# EAGLE design TG16_EXP_RGBSV_RevB (EAGLE 9.6.2)
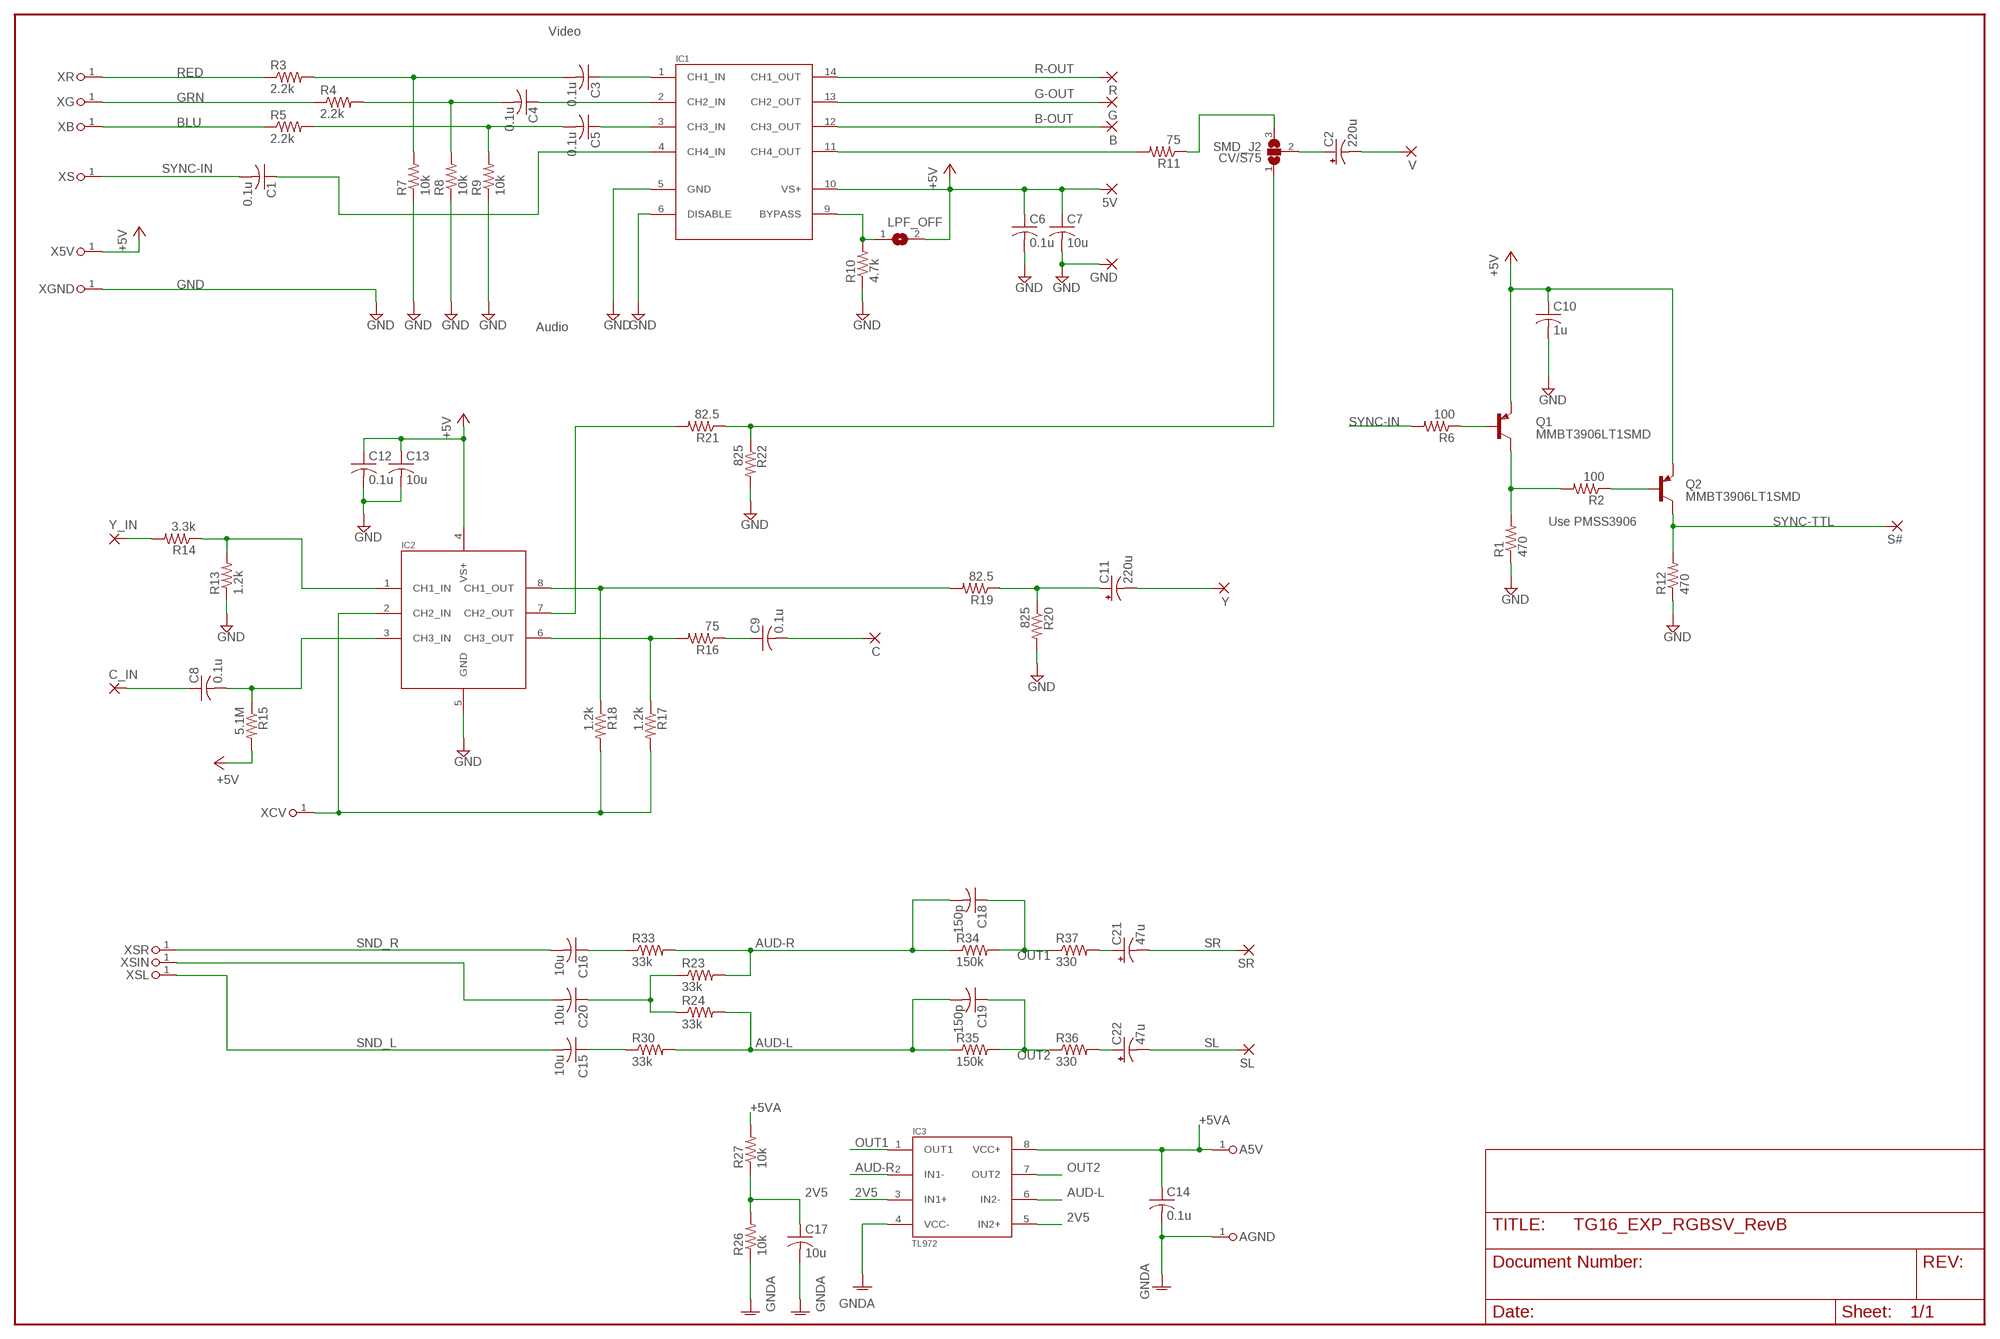
[diagram p0: schematic, sheet 1]

## Parts
5V  SMD2  [SMD1,27-2,54]
A5V  PINHD-1X1  [1X01]
AGND  PINHD-1X1  [1X01]
B  SMD2  [SMD1,27-2,54]
C  SMD2  [SMD1,27-2,54]
C1  0.1u  C-USC0603  [C0603]
C2  220u  CPOL-USCT3528  [CT3528]
C3  0.1u  C-USC0603  [C0603]
C4  0.1u  C-USC0603  [C0603]
C5  0.1u  C-USC0603  [C0603]
C6  0.1u  C-USC0603  [C0603]
C7  10u  C-USC1206  [C1206]
C8  0.1u  C-USC0603  [C0603]
C9  0.1u  C-USC0603  [C0603]
C10  1u  C-USC0603  [C0603]
C11  220u  CPOL-USCT3528  [CT3528]
C12  0.1u  C-USC0603  [C0603]
C13  10u  C-USC1206  [C1206]
C14  0.1u  C-USC0603  [C0603]
C15  10u  C-USC0805  [C0805]
C16  10u  C-USC0805  [C0805]
C17  10u  C-USC1206  [C1206]
C18  150p  C-USC0603  [C0603]
C19  150p  C-USC0603  [C0603]
C20  10u  C-USC0805  [C0805]
C21  47u  CPOL-USCT3528  [CT3528]
C22  47u  CPOL-USCT3528  [CT3528]
C_IN  SMD2  [SMD1,27-2,54]
CV/S75  SMD_J2  [SJ_2]
G  SMD2  [SMD1,27-2,54]
GND  SMD2  [SMD1,27-2,54]
IC1  THS7374TSSOP14_LONG  [TSSOP14LONG]
IC2  THS7314  [SOIC8]
IC3  TL972  [SOIC8]
LPF_OFF  SMD_J  [SJ]
Q1  MMBT3906LT1SMD  [SOT23-BEC]
Q2  MMBT3906LT1SMD  [SOT23-BEC]
R  SMD2  [SMD1,27-2,54]
R1  470  R-US_R0603  [R0603]
R2  100  R-US_R0603  [R0603]
R3  2.2k  R-US_R0603  [R0603]
R4  2.2k  R-US_R0603  [R0603]
R5  2.2k  R-US_R0603  [R0603]
R6  100  R-US_R0603  [R0603]
R7  10k  R-US_R0603  [R0603]
R8  10k  R-US_R0603  [R0603]
R9  10k  R-US_R0603  [R0603]
R10  4.7k  R-US_R0603  [R0603]
R11  75  R-US_R0603  [R0603]
R12  470  R-US_R0603  [R0603]
R13  1.2k  R-US_R0603  [R0603]
R14  3.3k  R-US_R0603  [R0603]
R15  5.1M  R-US_R0603  [R0603]
R16  75  R-US_R0603  [R0603]
R17  1.2k  R-US_R0603  [R0603]
R18  1.2k  R-US_R0603  [R0603]
R19  82.5  R-US_R0603  [R0603]
R20  825  R-US_R0603  [R0603]
R21  82.5  R-US_R0603  [R0603]
R22  825  R-US_R0603  [R0603]
R23  33k  R-US_R0603  [R0603]
R24  33k  R-US_R0603  [R0603]
R26  10k  R-US_R0603  [R0603]
R27  10k  R-US_R0603  [R0603]
R30  33k  R-US_R0603  [R0603]
R33  33k  R-US_R0603  [R0603]
R34  150k  R-US_R0603  [R0603]
R35  150k  R-US_R0603  [R0603]
R36  330  R-US_R0603  [R0603]
R37  330  R-US_R0603  [R0603]
S#  SMD2  [SMD1,27-2,54]
SL  SMD2  [SMD1,27-2,54]
SR  SMD2  [SMD1,27-2,54]
V  SMD2  [SMD1,27-2,54]
X5V  PINHD-1X1  [1X01]
XB  PINHD-1X1  [1X01]
XCV  PINHD-1X1  [1X01]
XG  PINHD-1X1  [1X01]
XGND  PINHD-1X1  [1X01]
XR  PINHD-1X1  [1X01]
XS  PINHD-1X1  [1X01]
XSIN  PINHD-1X1  [1X01]
XSL  PINHD-1X1  [1X01]
XSR  PINHD-1X1  [1X01]
Y  SMD2  [SMD1,27-2,54]
Y_IN  SMD2  [SMD1,27-2,54]

## Nets
2V5: C17.1 IC3.3(IN1+) IC3.5(IN2+) R26.2 R27.1
+5V: 5V.1(P) C6.1 C7.1 C10.1 C12.1 C13.1 IC1.10(VS+) IC2.4(VS+) LPF_OFF.2 Q1.E Q2.E R15.2 X5V.1
+5VA: A5V.1 C14.1 IC3.8(VCC+) R27.2
AUD-L: C19.2 IC3.6(IN2-) R24.2 R30.2 R35.1
AUD-R: C18.2 IC3.2(IN1-) R23.2 R33.2 R34.1
B-OUT: B.1(P) IC1.12(CH3_OUT)
BLU: R5.1 XB.1
G-OUT: G.1(P) IC1.13(CH2_OUT)
GND: C6.2 C7.2 C10.2 C12.2 C13.2 GND.1(P) IC1.5(GND) IC1.6(DISABLE) IC2.5(GND) R1.1 R7.1 R8.1 R9.1 R10.1 R12.1 R13.1 R20.2 R22.2 XGND.1
GNDA: AGND.1 C14.2 C17.2 IC3.4(VCC-) R26.1
GRN: R4.1 XG.1
N$1: Q1.B R6.1
N$2: C3.1 IC1.1(CH1_IN)
N$3: C3.2 R3.2 R7.2
N$4: C4.1 IC1.2(CH2_IN)
N$5: C4.2 R4.2 R8.2
N$6: C5.1 IC1.3(CH3_IN)
N$7: C1.1 IC1.4(CH4_IN)
N$8: C5.2 R5.2 R9.2
N$9: IC1.9(BYPASS) LPF_OFF.1 R10.2
N$10: Q1.C R1.2 R2.2
N$11: IC1.11(CH4_OUT) R11.2
N$12: Q2.B R2.1
N$13: C2.+ CV/S75.2
N$14: C2.- V.1(P)
N$15: R14.2 Y_IN.1(P)
N$16: IC2.1(CH1_IN) R13.2 R14.1
N$17: C8.1 C_IN.1(P)
N$18: C8.2 IC2.3(CH3_IN) R15.1
N$19: IC2.8(CH1_OUT) R18.1 R19.2
N$20: IC2.6(CH3_OUT) R16.2 R17.1
N$21: C9.1 R16.1
N$22: C9.2 C.1(P)
N$23: IC2.2(CH2_IN) R17.2 R18.2 XCV.1
N$24: C11.+ R19.1 R20.1
N$25: C11.- Y.1(P)
N$26: IC2.7(CH2_OUT) R21.2
N$27: CV/S75.3 R11.1
N$28: CV/S75.1 R21.1 R22.1
N$29: C16.1 R33.1
N$30: C20.2 XSIN.1
N$31: C20.1 R23.1 R24.1
N$34: C15.1 R30.1
N$41: C22.+ R36.2
N$42: C21.+ R37.2
OUT1: C18.1 IC3.1(OUT1) R34.2 R37.1
OUT2: C19.1 IC3.7(OUT2) R35.2 R36.1
R-OUT: IC1.14(CH1_OUT) R.1(P)
RED: R3.1 XR.1
SL: C22.- SL.1(P)
SND_L: C15.2 XSL.1
SND_R: C16.2 XSR.1
SR: C21.- SR.1(P)
SYNC-IN: C1.2 R6.2 XS.1
SYNC-TTL: Q2.C R12.2 S#.1(P)

## Notes on the sheet
- Video
- Audio
- Use PMSS3906

## Library data of the parts
5V B C C_IN G GND R S# SL SR V Y Y_IN = wirepad:SMD2: SMD PAD
A5V AGND X5V XB XCV XG XGND XR XS XSIN XSL XSR = My_Devices:PINHD-1X1: PIN HEADER
C1 C3-C10 C12-C20 = My_Devices:C-US: CAPACITOR, American symbol
C2 C11 = rcl:CPOL-US: POLARIZED CAPACITOR, American symbol; SPICEPREFIX: C
C21 C22 = My_Devices:CPOL-US: POLARIZED CAPACITOR, American symbol; SPICEPREFIX: C
CV/S75 = My_Devices:SMD_J2
IC1 = My_Devices:THS7374
IC2 = My_Devices:THS7314
IC3 = My_Devices:TL972
LPF_OFF = My_Devices:SMD_J
Q1 Q2 = transistor-pnp:MMBT3906*: PNP Transistror
R1-R24 R26 R27 R30 R33-R37 = My_Devices:R-US_: RESISTOR, American symbol

## Board
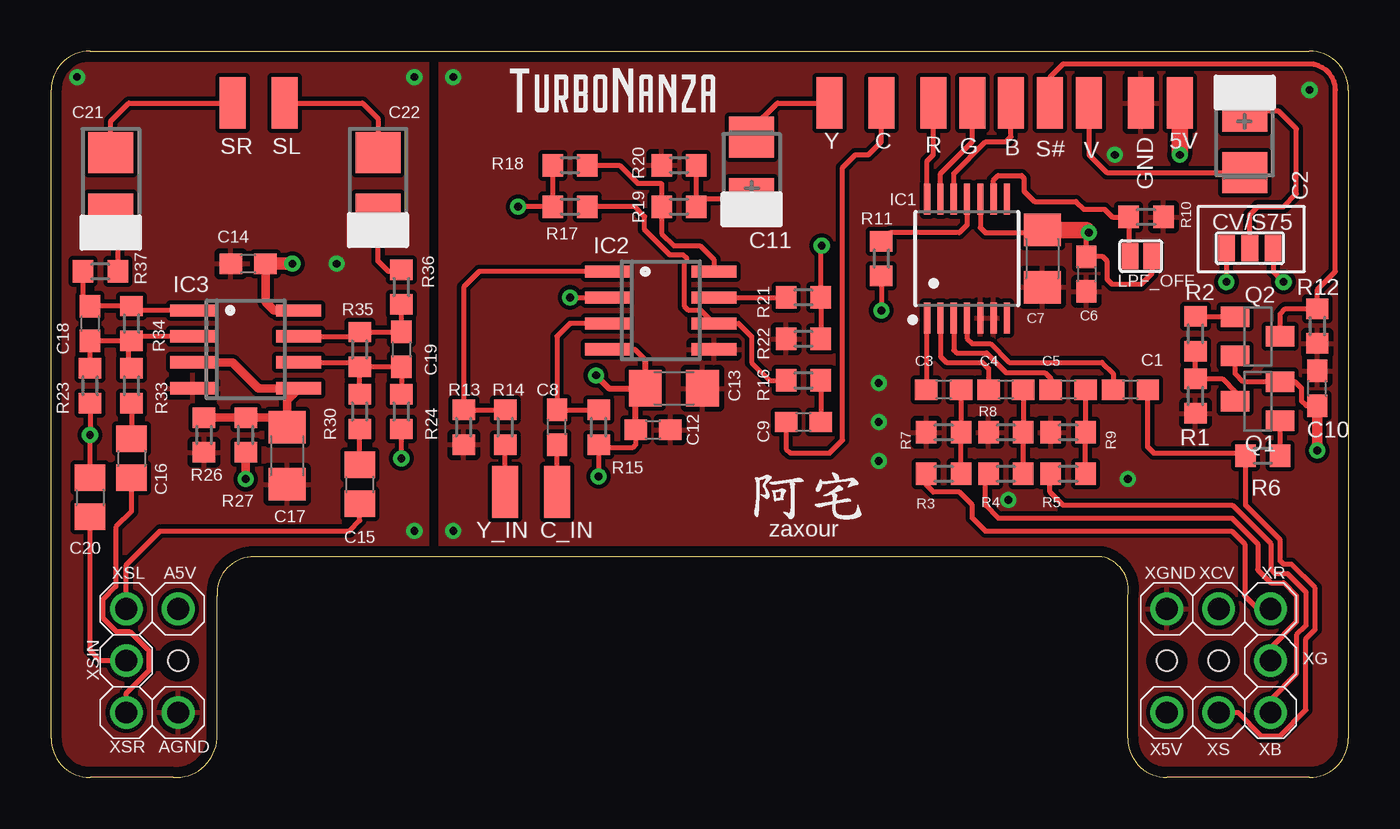
[diagram p1: board, top side]
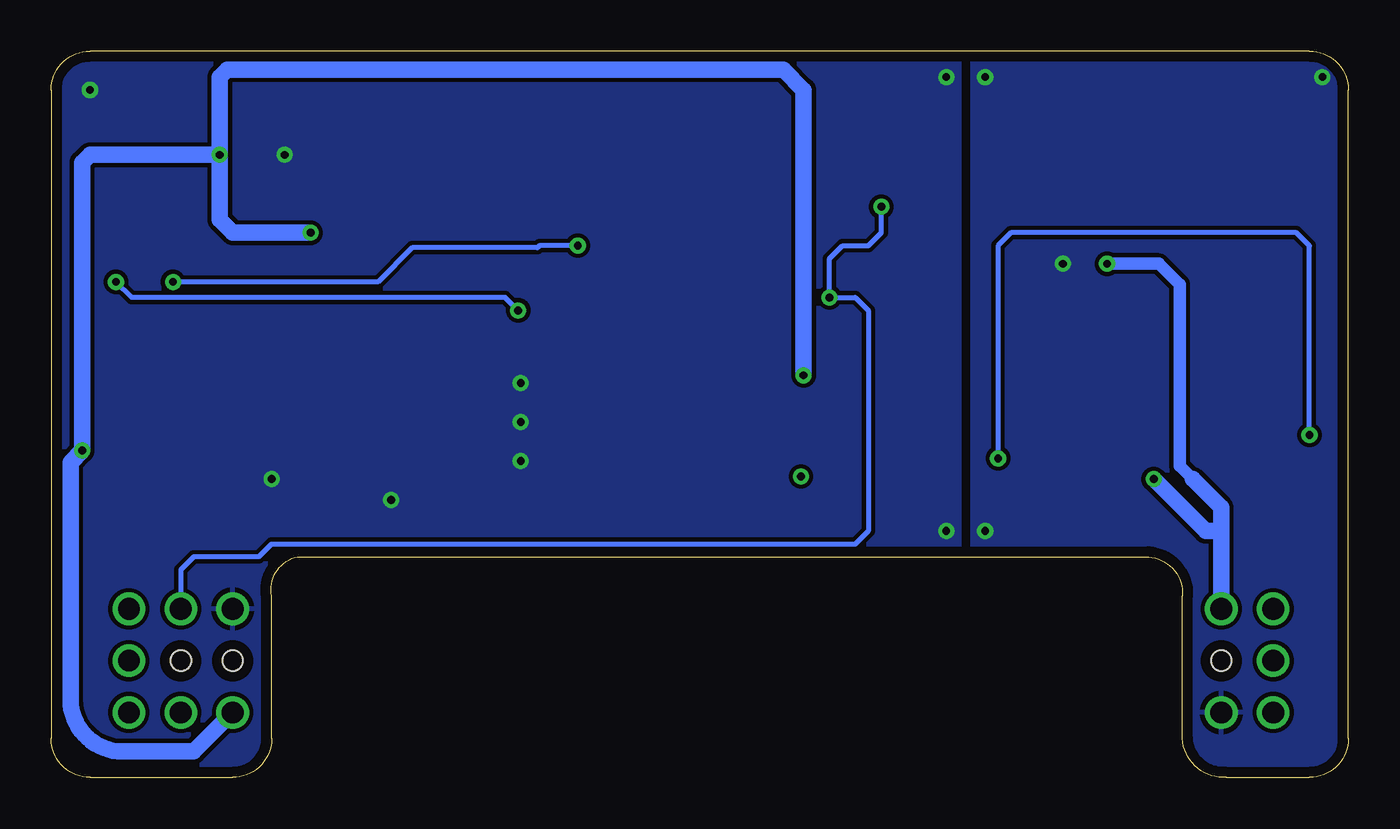
[diagram p2: board, bottom side, seen from below]

Size 63.5 x 35.56 mm. Coordinates in mm from the lower left corner, seen from the top.
Outline: 0,1.91 0,33.66 arc-90 1.91,35.56 61.59,35.56 arc-90 63.5,33.66 63.5,1.91 arc-90 61.59,0 54.61,0 arc-90 52.7,1.91 52.7,8.89 arc90 51.44,10.8 9.78,10.8 arc90 8.13,8.89 8.13,1.91 arc-90 5.97,0 1.91,0 arc-90 0,1.91
Copper layers (1*16): Top 0.035mm / dielectric 1.5mm / Bottom 0.035mm
Design rules "default *": minimum track width 5mil, minimum drill 10mil, track to track 8mil, track to pad 8mil, pad to pad 8mil, via to via 8mil, smd to smd 8mil, copper to edge 20mil, drill to drill 8mil, minimum pad ring 10mil, minimum via ring 8mil, stop-mask expansion 4mil, vias tented up to drill 18mil, thermal gap 10mil
Holes 0.99 mm at 54.61,5.72 57.15,5.72 6.22,5.72

### Footprints (pad centres in the part's own frame; a part is rotated, then mirrored left to right if it is on the bottom)
SMD1,27-2,54 = smd 1.27 x 2.54: 1 0,0
1X01 = drill 1.067 pad 1.575: 1 0,0
C0603 = smd 1.1 x 1: 1 -0.85,0; 2 0.85,0
CT3528 = smd 2 x 2.2: + -1.5,0; - 1.5,0
C1206 = smd 1.6 x 1.8: 1 -1.4,0; 2 1.4,0
C0805 = smd 1.3 x 1.5: 1 -0.95,0; 2 0.95,0
SJ_2 = smd 0.813 x 1.27: 1 -1.143,0; 2 0,0; 3 1.143,0
TSSOP14LONG = smd 0.305 x 1.524: 1 -1.95,-2.918; 2 -1.3,-2.918; 3 -0.65,-2.918; 4 0,-2.918; 5 0.65,-2.918; 6 1.3,-2.918; 7 1.95,-2.918; 8 1.95,2.918; 9 1.3,2.918; 10 0.65,2.918; 11 0,2.918; 12 -0.65,2.918; 13 -1.3,2.918; 14 -1.95,2.918
SOIC8 = smd 0.6 x 2.2: 1 -1.905,-2.6; 2 -0.635,-2.6; 3 0.635,-2.6; 4 1.905,-2.6; 5 1.905,2.6; 6 0.635,2.6; 7 -0.635,2.6; 8 -1.905,2.6
SJ = smd 0.813 x 1.27: 1 -0.533,0; 2 0.533,0
SOT23-BEC = smd 1 x 1.4: B -0.95,-1.1; C 0,1.1; E 0.95,-1.1
R0603 = smd 1 x 1.1: 1 -0.85,0; 2 0.85,0

### Placement (x,y rotation side)
5V  55.24,33.02 0 top
A5V  6.22,8.26 0 top
AGND  6.22,3.18 0 top
B  46.99,33.02 180 top
C  40.64,33.02 0 top
C1  52.83,18.99 0 top
C2  58.42,31.12 270 top
C3  43.69,18.99 0 top
C4  46.74,18.99 0 top
C5  49.78,18.99 0 top
C6  50.67,24.64 270 top
C7  48.51,25.4 270 top
C8  24.77,17.15 90 top
C9  36.83,17.4 180 top
C10  61.98,19.05 90 top
C11  34.29,29.85 90 top
C12  29.46,17.02 0 top
C13  30.48,19.05 0 top
C14  9.65,25.15 180 top
C15  15.11,14.35 270 top
C16  3.94,15.62 270 top
C17  11.56,15.75 270 top
C18  1.91,22.23 270 top
C19  17.14,20.96 270 top
C20  1.91,13.72 270 top
C21  2.92,29.09 90 top
C22  16,29.09 90 top
C_IN  24.77,13.97 0 top
CV/S75  58.67,25.91 0 top
G  45.09,33.02 180 top
GND  53.34,33.02 180 top
IC1  44.83,25.4 0 top
IC2  29.84,22.86 270 top
IC3  9.53,20.96 270 top
LPF_OFF  53.34,25.53 0 top
Q1  59.05,18.42 90 top
Q2  59.05,21.59 270 top
R  43.18,33.02 180 top
R1  56.01,18.67 90 top
R2  56.01,21.72 270 top
R3  43.69,14.86 0 top
R4  46.74,14.86 0 top
R5  49.78,14.86 0 top
R6  59.31,15.75 180 top
R7  43.69,16.89 0 top
R8  46.74,16.89 0 top
R9  49.78,16.89 0 top
R10  53.59,27.44 180 top
R11  40.64,25.4 90 top
R12  61.98,22.1 90 top
R13  20.19,17.15 90 top
R14  22.23,17.15 270 top
R15  26.8,17.15 270 top
R16  36.83,19.43 180 top
R17  25.4,27.94 180 top
R18  25.4,29.98 180 top
R19  30.73,27.94 180 top
R20  30.73,29.98 180 top
R21  36.83,23.5 180 top
R22  36.83,21.47 180 top
R23  1.91,19.18 90 top
R24  17.14,17.91 90 top
R26  7.49,16.77 90 top
R27  9.53,16.77 270 top
R30  15.11,17.91 90 top
R33  3.94,19.18 90 top
R34  3.94,22.23 90 top
R35  15.11,20.96 90 top
R36  17.14,24.01 90 top
R37  2.41,24.77 0 top
S#  48.9,33.02 0 top
SL  11.43,33.02 0 top
SR  8.89,33.02 0 top
V  50.8,33.02 180 top
X5V  54.61,3.18 0 top
XB  59.69,3.18 0 top
XCV  57.15,8.26 0 top
XG  59.69,5.72 0 top
XGND  54.61,8.26 0 top
XR  59.69,8.26 0 top
XS  57.15,3.18 0 top
XSIN  3.68,5.72 0 top
XSL  3.68,8.26 0 top
XSR  3.68,3.18 0 top
Y  38.1,33.02 0 top
Y_IN  22.23,13.97 0 top

### Tracks (layer width: path | path; a pad name or v marks a point on that pad's centre or on a via)
2V5
  Top 0.406: IC3.3 8.89,20.32 10.16,19.05 IC3.5 11.56,18.49 C17.1 11.09,17.62 R27.1 R26.2
+5V  (via drill 0.38)
  Top 0.254: IC1.10 45.48,26.91 45.72,26.67 48.38,26.67 C7.1 | C10.1 61.43,18.2 61.21,18.42 61.21,19.05 60.9,19.37 Q1.E 58.36,19.37 57.95,19.77 Q2.E | 50.67,26.8 C6.1 51.47,25.49 51.69,25.28 51.69,24.39 51.94,24.13 53.34,24.13 53.87,24.67 LPF_OFF.2 | v26.8,14.74 R15.2 26.96,16.13 28.45,16.13 28.61,16.3 C12.1 | IC2.4 28.57,20.96 29.08,20.45
  Top 0.305: v26.67,19.69 27.3,19.05 C13.1 | C12.1 28.61,18.59 C13.1 | 29.08,20.45 C13.1
  Top 0.508: v61.98,16.01 C10.1
  Top 0.813: C7.1 50.67,26.8 v50.8,26.67 | 5V.1 v55.24,30.48
  Bottom 0.813: X5V.1 56.52,1.27 60.01,1.27 arc90 62.55,3.81 62.55,15.43 v61.98,16.01 61.98,30.1 61.59,30.48 v55.24,30.48 | v26.67,19.69 26.67,33.66 27.66,34.65 54.89,34.65 55.24,34.29 v55.24,30.48 | v55.24,30.48 55.24,27.31 54.61,26.67 v50.8,26.67
+5VA  (via drill 0.38)
  Top 0.406: IC3.8 10.92,22.86 10.5,23.28 C14.1 | R27.2 v9.53,14.61
  Top 0.61: v11.81,25.15 C14.1
  Bottom 0.61: 7.62,14.61 8.26,15.24 8.26,24.13 9.27,25.15 v11.81,25.15
  Bottom 0.813: 7.62,14.61 6.22,13.21 6.22,12.07 | A5V.1 6.22,12.07 | v9.53,14.61 6.99,12.07 6.22,12.07
AUD-L
  Top 0.254: R30.2 R35.1 | IC3.6 14.9,20.32 R35.1 | R35.1 C19.2 R24.2
AUD-R
  Top 0.254: R34.1 3.81,21.38 | 3.81,21.38 C18.2 R23.2 | R33.2 3.81,20.16 3.81,21.38 | 3.81,21.38 4.03,21.59 IC3.2
B-OUT
  Top 0.254: IC1.12 44.18,29.57 45.73,31.12 46.74,31.12 46.99,31.37 B.1
BLU
  Top 0.254: R5.1 48.9,14.82 48.9,13.97 49.53,13.34 57.81,13.34 59.69,11.46 59.69,10.18 59.88,9.99 60.51,9.99 61.42,9.08 61.42,7.43 60.96,6.98 60.96,5.08 59.69,3.81 XB.1
G-OUT
  Top 0.254: IC1.13 43.53,29.56 45.09,31.12 G.1
GND  (via drill 0.38)
  other vias: 46.86,13.59 40.51,19.31 40.51,17.4 40.51,15.5 52.07,30.48 19.68,34.29 52.7,14.61 61.59,33.66 19.68,12.07
  pour Top: 19.05,41.91 67.31,41.91 67.31,-4.44 19.05,-4.44
  pour Bottom (rank 2): 19.05,43.18 64.14,43.18 64.14,-1.27 19.05,-1.27
GNDA  (via drill 0.38)
  other vias: 13.97,25.15 17.78,12.07 17.78,34.29 1.27,34.29
  pour Bottom: -1.91,-1.27 -1.91,36.2 18.41,36.2 18.41,-1.27
  pour Top: 18.41,-0.63 18.41,36.83 -0.64,36.83 -0.64,-0.63
GRN
  Top 0.254: R4.1 45.72,14.7 45.72,13.34 46.35,12.7 57.8,12.7 59.05,11.45 59.05,10.16 59.69,9.53 60.33,9.53 60.96,8.89 60.96,7.62 59.69,6.35 XG.1
N$1
  Top 0.254: Q1.B R6.1
N$2
  Top 0.254: IC1.1 42.84,22.44 C3.1
N$3
  Top 0.254: R3.2 R7.2 C3.2
N$4
  Top 0.254: IC1.2 43.53,20.61 43.81,20.32 45.59,20.32 45.89,20.03 C4.1
N$5
  Top 0.254: R4.2 R8.2 C4.2
N$6
  Top 0.254: IC1.3 44.18,20.92 44.32,20.78 45.78,20.78 46.74,19.82 48.27,19.82 48.28,19.82 48.64,19.82 48.93,19.52 C5.1
N$7
  Top 0.254: IC1.4 44.83,21.49 45.09,21.24 45.97,21.24 46.89,20.32 51.44,20.32 51.98,19.78 C1.1
N$8
  Top 0.254: R5.2 R9.2 C5.2
N$9
  Top 0.254: IC1.9 46.13,29.24 46.35,29.47 47.5,29.47 47.62,29.34 47.62,28.71 48.13,28.2 50.16,28.2 50.55,27.82 51.56,27.82 51.94,27.44 R10.2 52.74,25.59 LPF_OFF.1
N$10
  Top 0.254: R2.2 R1.2 57.32,19.52 57.95,18.88 Q1.C
N$11
  Top 0.254: IC1.11 44.83,27.05 44.45,26.67 41.06,26.67 R11.2
N$12
  Top 0.254: R2.1 57.93,22.57 Q2.B
N$13
  Top 0.254: CV/S75.2 58.67,27.56 59.05,27.94 60.33,27.94 60.96,28.58 60.96,31.75 60.09,32.62 C2.+
N$14
  Top 0.254: V.1 50.8,30.48 51.66,29.62 C2.-
N$15
  Top 0.254: Y_IN.1 R14.2
N$16
  Top 0.254: R14.1 R13.2 20.19,24.01 20.95,24.77 IC2.1
N$17
  Top 0.254: C_IN.1 C8.1
N$18
  Top 0.254: IC2.3 25.4,22.23 24.77,21.59 C8.2 R15.1
N$19
  Top 0.254: IC2.8 32.45,25.34 31.75,26.04 30.48,26.04 29.88,26.63 R19.2 29.88,29.06 29.84,29.1 28.69,29.1 27.81,29.98 R18.1
N$20
  Top 0.254: R16.2 35.18,19.43 34.29,20.32 34.29,21.59 33.66,22.23 IC2.6 31.8,22.87 31.21,22.87 31.02,23.06 31.02,25.21 31.11,25.31 31.11,25.4 30.94,25.58 30.29,25.58 29.05,26.82 29.05,27.46 28.57,27.94 R17.1
N$21
  Top 0.254: R16.1 C9.1
N$22
  Top 0.254: C9.2 35.98,16.09 36.2,15.88 38.1,15.88 38.73,16.51 38.73,29.85 39.37,30.48 40.01,30.48 40.64,31.12 C.1
N$23  (via drill 0.38)
  Top 0.254: v25.4,23.5 IC2.2 | R18.2 R17.2 v22.86,27.94
  Bottom 0.254: XCV.1 57.15,10.16 56.52,10.8 53.34,10.8 52.7,11.43 24.13,11.43 23.5,12.07 23.5,22.86 24.13,23.5 v25.4,23.5 25.4,25.4 24.77,26.04 23.5,26.04 22.86,26.67 v22.86,27.94
N$24
  Top 0.254: R20.1 R19.1 31.99,28.35 C11.+
N$25
  Top 0.254: C11.- 34.29,31.75 35.56,33.02 Y.1
N$26
  Top 0.254: IC2.7 R21.2
N$27  (via drill 0.38)
  Top 0.254: R11.1 v40.64,22.86 | CV/S75.3 59.82,24.77 v60.33,24.26
  Bottom 0.254: v60.33,24.26 59.56,23.5 41.27,23.5 v40.64,22.86
N$28  (via drill 0.38)
  Top 0.254: R22.1 R21.1 37.68,26 v37.72,26.04 | CV/S75.1 v57.53,24.26
  Bottom 0.254: v37.72,26.04 39.6,26.04 39.7,25.94 45.82,25.94 47.5,24.26 v57.53,24.26
N$29
  Top 0.254: R33.1 C16.1
N$30
  Top 0.254: XSIN.1 2.41,5.72 1.91,6.23 C20.2
N$31  (via drill 0.38)
  Top 0.254: C20.1 v1.91,16.77 R23.1 | v17.14,15.62 R24.1
  Bottom 0.254: v1.91,16.77 1.91,26.04 2.54,26.67 16.51,26.67 17.14,26.04 v17.14,15.62
N$34
  Top 0.254: C15.1 R30.1
N$41
  Top 0.254: R36.2 17.06,24.77 16.51,24.77 16,25.28 C22.+
N$42
  Top 0.254: C21.+ 3.26,27.24 R37.2
OUT1
  Top 0.254: IC3.1 4.15,22.86 R34.2 C18.1 1.56,23.42 R37.1
OUT2
  Top 0.254: C19.1 17.14,22.23 | 17.14,22.23 R36.1 | IC3.7 14.9,21.59 R35.2 16.73,21.81 17.14,22.23
R-OUT
  Top 0.254: IC1.14 42.88,30.18 43.18,30.48 R.1
RED
  Top 0.254: R3.1 42.84,14.32 43.18,13.97 44.45,13.97 45.09,13.34 45.09,12.7 45.72,12.07 57.78,12.07 58.42,11.43 58.42,8.89 59.05,8.26 XR.1
SL
  Top 0.254: SL.1 15.24,33.02 16,32.26 C22.-
SND_L
  Top 0.254: XSL.1 3.68,10.42 5.33,12.07 14.61,12.07 15.11,12.58 C15.2
SND_R
  Top 0.254: XSR.1 3.68,4.12 4.81,5.25 4.81,6.19 3.87,7.13 3.21,7.13 2.55,7.79 2.55,8.73 3.17,9.35 3.17,12.26 3.94,13.02 C16.2
SR
  Top 0.254: C21.- 2.92,32.13 3.81,33.02 SR.1
SYNC-IN
  Top 0.254: C1.2 53.68,16.17 53.98,15.88 58.33,15.88 R6.2 58.46,13.33 60.15,11.65 60.15,10.62 60.33,10.44 60.7,10.44 61.87,9.27 61.87,7.24 61.42,6.79 61.42,3.31 60.16,2.05 59.22,2.05 58.09,3.18 XS.1
SYNC-TTL
  Top 0.254: Q2.C 60.16,22.69 60.41,22.95 R12.2 61.98,23.88 62.87,24.77 62.87,33.66 62.85,33.88 62.79,34.09 62.7,34.29 62.57,34.47 62.41,34.63 62.23,34.76 62.03,34.85 61.82,34.91 61.59,34.93 49.53,34.93 48.9,34.29 S#.1

### Text on the board
tPlace: zaxour
tValues: OFF